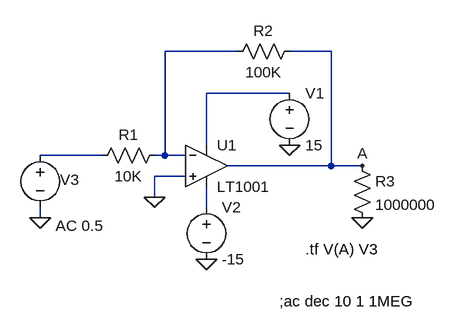
[diagram p0: schematic t3C.asc]
t3C.asc, the LTspice schematic file:
Version 4
SHEET 1 880 680
WIRE 224 -32 112 -32
WIRE 368 -32 304 -32
WIRE 304 32 176 32
WIRE 176 112 176 32
WIRE 16 128 -80 128
WIRE 112 128 112 -32
WIRE 112 128 96 128
WIRE 144 128 112 128
WIRE 368 144 368 -32
WIRE 368 144 208 144
WIRE 416 144 368 144
WIRE 144 160 96 160
WIRE 96 192 96 160
WIRE 176 208 176 176
WIRE -80 224 -80 208
FLAG -80 224 0
FLAG 304 112 0
FLAG 176 288 0
FLAG 96 192 0
FLAG 416 224 0
FLAG 416 144 A
SYMBOL res 112 112 R90
WINDOW 0 0 56 VBottom 2
WINDOW 3 32 56 VTop 2
SYMATTR InstName R1
SYMATTR Value 10K
SYMBOL res 320 -48 R90
WINDOW 0 0 56 VBottom 2
WINDOW 3 32 56 VTop 2
SYMATTR InstName R2
SYMATTR Value 100K
SYMBOL voltage 304 16 R0
WINDOW 123 0 0 Left 2
WINDOW 39 0 0 Left 2
SYMATTR InstName V1
SYMATTR Value 15
SYMBOL voltage 176 192 R0
WINDOW 123 0 0 Left 2
WINDOW 39 0 0 Left 2
SYMATTR InstName V2
SYMATTR Value -15
SYMBOL voltage -80 112 R0
WINDOW 0 31 53 Left 2
WINDOW 123 24 124 Left 2
WINDOW 39 0 0 Left 2
SYMATTR InstName V3
SYMATTR Value ""
SYMATTR Value2 AC 0.5
SYMBOL Opamps\\LT1001 176 80 R0
SYMATTR InstName U1
SYMBOL res 400 128 R0
SYMATTR InstName R3
SYMATTR Value 1000000
TEXT 288 352 Left 2 !;ac dec 10 1 1MEG
TEXT 328 272 Left 2 !.tf V(A) V3

The netlist it stands for:
* t3C.asc
R1 N001 N003 10K
R2 A N001 100K
V1 N002 0 15
V2 N004 0 -15
V3 N003 0 AC 0.5
XU1 0 N001 N002 N004 A LT1001  ; pins In+ In- V+ V- OUT
R3 A 0 1000000
;ac dec 10 1 1MEG
.tf V(A) V3
.lib LTC.lib
.backanno
.end